# EAGLE schematic mapleCUL_small-V11_02 (EAGLE 9.1.0)
MAPLE-CUx Large Version
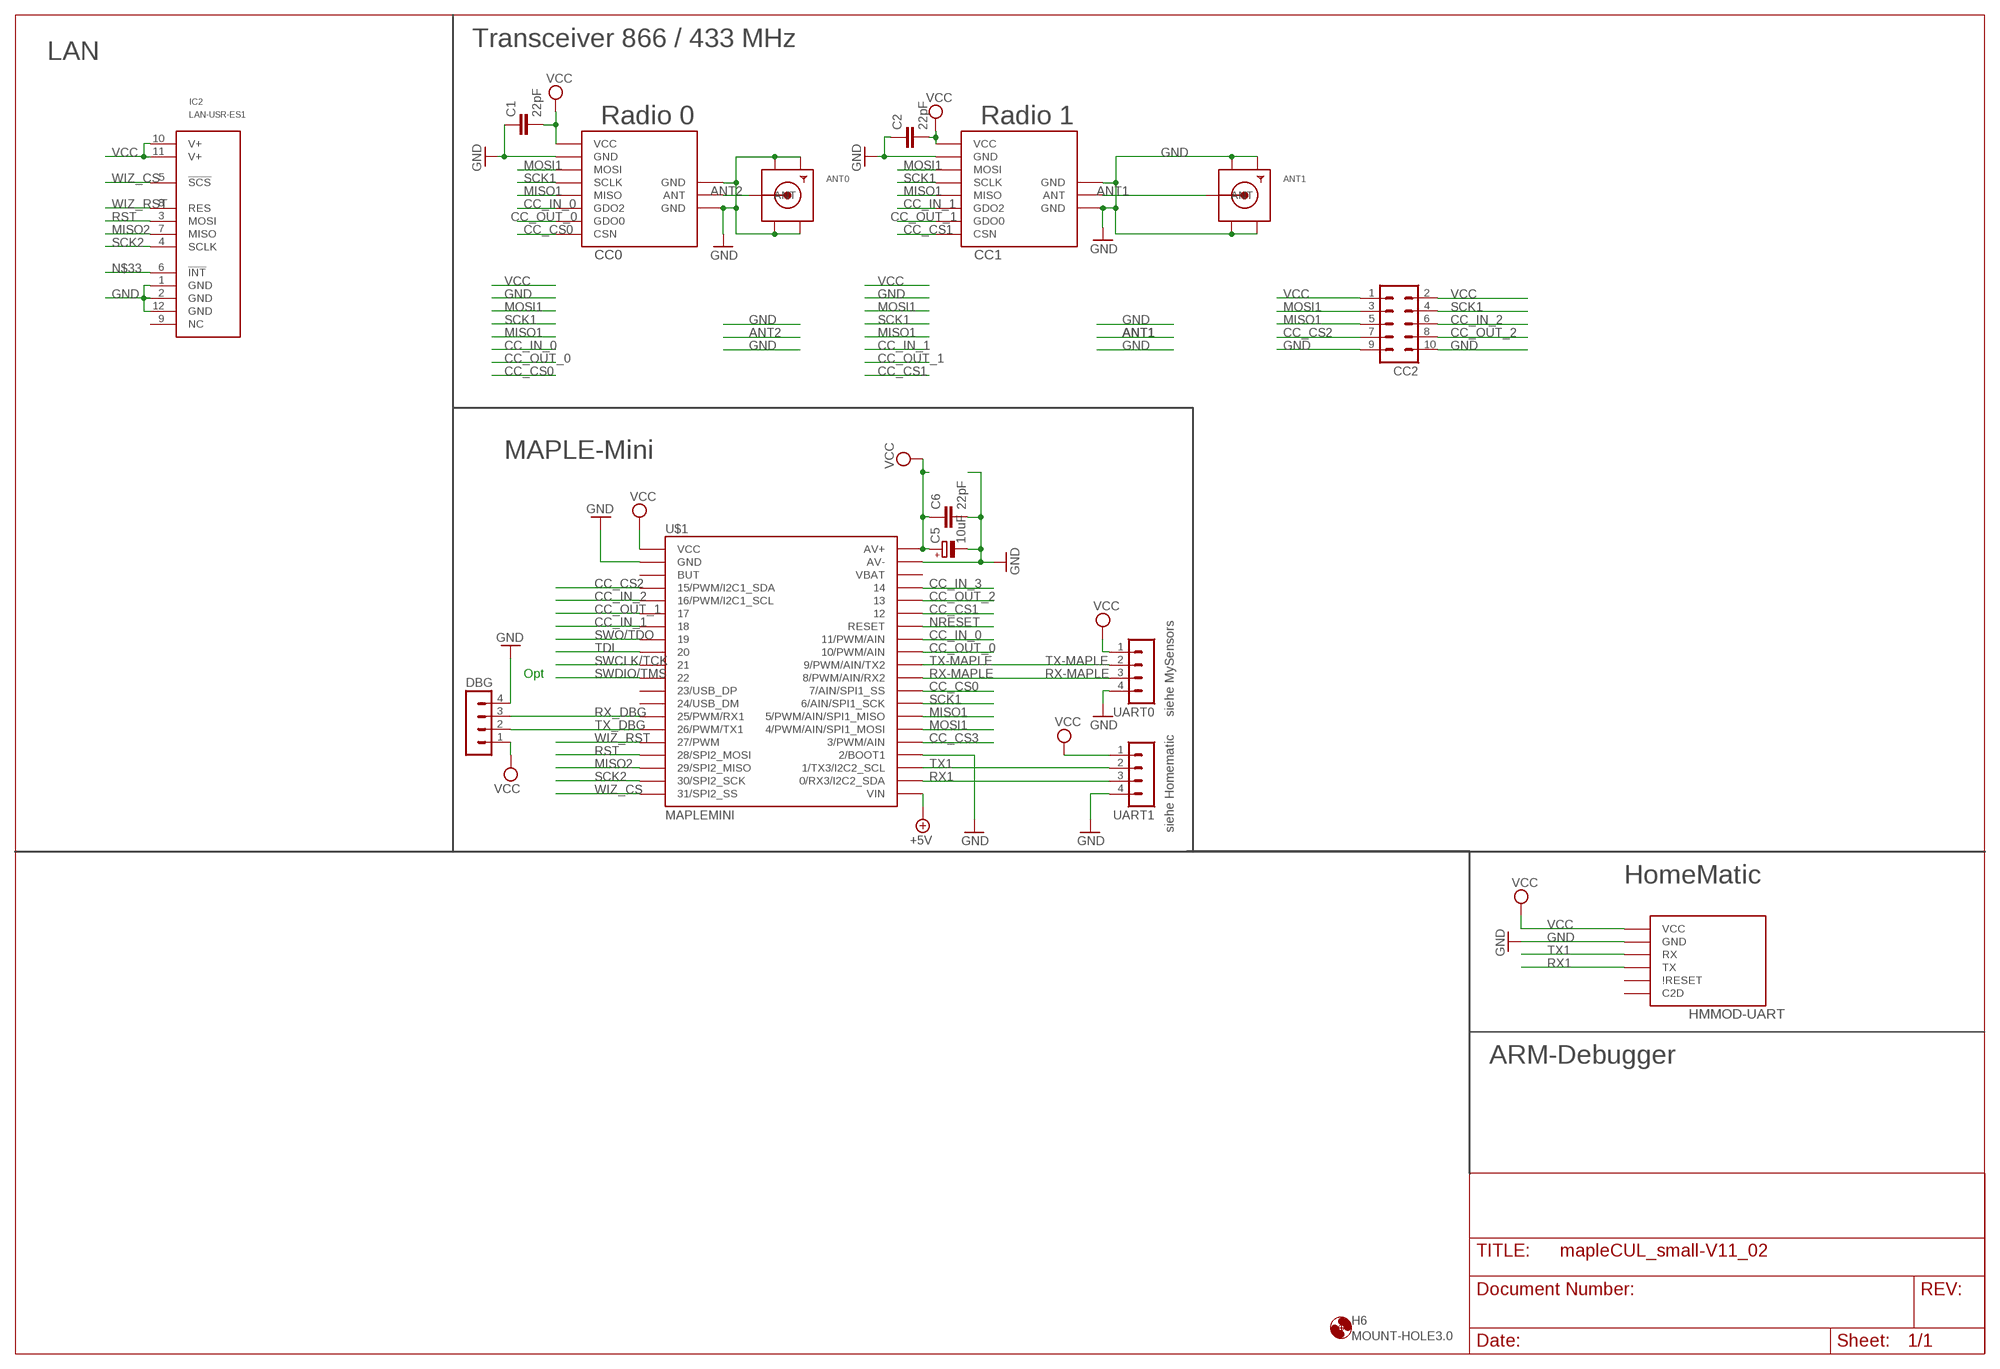
[diagram p0: schematic, sheet 1]

## Parts
ANT0  SMACONNECTOR_EDGE_UFL  [SMA_EDGELAUNCH_UFL]
ANT1  SMACONNECTOR_EDGE_UFL  [SMA_EDGELAUNCH_UFL]
C1  22pF  C-EUC0805  [C0805]
C2  22pF  C-EUC0805  [C0805]
C5  10uF  CPOL-EUR/2012-12W  [R/2012-12W]
C6  22pF  C-EUC0805  [C0805]
CC0  CC1101  CC1101_MODULE1SMD  [CC1101_MODULE1_SMD]
CC1  CC1101_MODULE1SMD  [CC1101_MODULE1_SMD]
CC2  MA05-2  [MA05-2]
DBG  MA04-1  [MA04-1]
H6  MOUNT-HOLE3.0  [3,0]
HMMOD-UART  HM-MOD-UARTDIL  [HM-MOD-UART-DIL]
IC2  LAN-USR-ES1  [USR-ES1]
U$1  MAPLEMINI  [20-DIP]
UART0  MA04-1  [MA04-1]
UART1  MA04-1  [MA04-1]

## Nets
+5V [PWR]: U$1.21(VIN)
ANT1 [PWR]: ANT1.P(ANT) CC1.ANT
ANT2: ANT0.P(ANT) CC0.ANT
CC_CS0: CC0.CSN U$1.29(7/AIN/SPI1_SS)
CC_CS1: CC1.CSN U$1.35
CC_CS2: CC2.7 U$1.4(15/PWM/I2C1_SDA)
CC_CS3: U$1.25(3/PWM/AIN)
CC_IN_0: CC0.GDO2 U$1.33(11/PWM/AIN)
CC_IN_1: CC1.GDO2 U$1.7
CC_IN_2: CC2.6 U$1.5(16/PWM/I2C1_SCL)
CC_IN_3: U$1.37
CC_OUT_0: CC0.GDO0 U$1.32(10/PWM/AIN)
CC_OUT_1: CC1.GDO0 U$1.6
CC_OUT_2: CC2.8 U$1.36
GND [PWR]: ANT0.GND@1(GND1) ANT0.GND@2(GND2) ANT0.GND@3(GND3) ANT0.GND@4(GND4) ANT1.GND@1(GND1) ANT1.GND@2(GND2) ANT1.GND@3(GND3) ANT1.GND@4(GND4) C1.1 C2.1 C5.- C6.2 CC0.GND@0(GND) CC0.GND@1(GND) CC0.GND@2(GND) CC1.GND@0(GND) CC1.GND@1(GND) CC1.GND@2(GND) CC2.9 CC2.10 DBG.4 HMMOD-UART.2(GND) IC2.1(GND) IC2.2(GND) IC2.12(GND) U$1.2(GND) U$1.24(2/BOOT1) U$1.39(AV-) UART0.4 UART1.4
MISO1: CC0.MISO CC1.MISO CC2.5 U$1.27(5/PWM/AIN/SPI1_MISO)
MISO2: IC2.7(MISO) U$1.18(29/SPI2_MISO)
MOSI1: CC0.MOSI CC1.MOSI CC2.3 U$1.26(4/PWM/AIN/SPI1_MOSI)
N$33: IC2.6(!INT!)
NRESET: U$1.34(RESET)
RST: IC2.3(MOSI) U$1.17(28/SPI2_MOSI)
RX1: HMMOD-UART.5(TX) U$1.22(0/RX3/I2C2_SDA) UART1.3
RX-MAPLE: U$1.30(8/PWM/AIN/RX2) UART0.3
RX_DBG: DBG.3 U$1.14(25/PWM/RX1)
SCK1: CC0.SCLK CC1.SCLK CC2.4 U$1.28(6/AIN/SPI1_SCK)
SCK2: IC2.4(SCLK) U$1.19(30/SPI2_SCK)
SWCLK/TCK: U$1.10
SWDIO/TMS: U$1.11
SWO/TDO: U$1.8
TDI: U$1.9
TX1: HMMOD-UART.6(RX) U$1.23(1/TX3/I2C2_SCL) UART1.2
TX-MAPLE: U$1.31(9/PWM/AIN/TX2) UART0.2
TX_DBG: DBG.2 U$1.15(26/PWM/TX1)
VCC [PWR]: C1.2 C2.2 C5.+ C6.1 CC0.VCC CC1.VCC CC2.1 CC2.2 DBG.1 HMMOD-UART.1(VCC) IC2.10(V+) IC2.11(V+) U$1.1(VCC) U$1.40(AV+) UART0.1 UART1.1
WIZ_CS: IC2.5(!SCS!) U$1.20(31/SPI2_SS)
WIZ_RST: IC2.8(RES) U$1.16(27/PWM)
Unconnected: HMMOD-UART.3(C2D) HMMOD-UART.4(\!RESET) IC2.9(NC) U$1.3(BUT) U$1.12(23/USB_DP) U$1.13(24/USB_DM) U$1.38(VBAT)

## Notes on the sheet
- Transceiver 866 / 433 MHz
- LAN
- Radio 0 | Radio 1
- MAPLE-Mini
- Opt
- siehe MySensors
- siehe Homematic
- HomeMatic
- ARM-Debugger

## Library data of the parts
ANT0 ANT1 = adafruit:SMACONNECTOR: SMA Connector 90° DIP SMA Connector, 50 Ohm (4UConnector: 07259)
C1 C2 C6 = rcl:C-EU: CAPACITOR, European symbol
C5 = rcl:CPOL-EU: POLARIZED CAPACITOR, European symbol
CC0 CC1 = wireless:CC1101_MODULE1: CC1101 wireless module for 433/868 MHz (sold from Aliexpress). DIL version for mounting with pin header (and SMD soldering) and SMD only variant available.
CC2 = con-lstb:MA05-2: PIN HEADER; OC_FARNELL: unknown; OC_NEWARK: unknown
DBG UART0 UART1 = con-lstb:MA04-1: PIN HEADER; OC_FARNELL: unknown; OC_NEWARK: unknown
H6 = holes:MOUNT-HOLE: MOUNTING HOLE with drill center marker
HMMOD-UART = wireless:HM-MOD-UART: eQ3 HM-MOD-UART-AW-SH2 wireless module for 868 MHz. DIL version for mounting with pin header (antenna upwards) and SMD variant available (antenna downwards).
IC2 = Martin-Communication:LAN-USR-ES1
U$1 = maplemini-small:MAPLEMINI

## Net classes
0 default: width 0.305 mm
1 PWR: width 0.406 mm